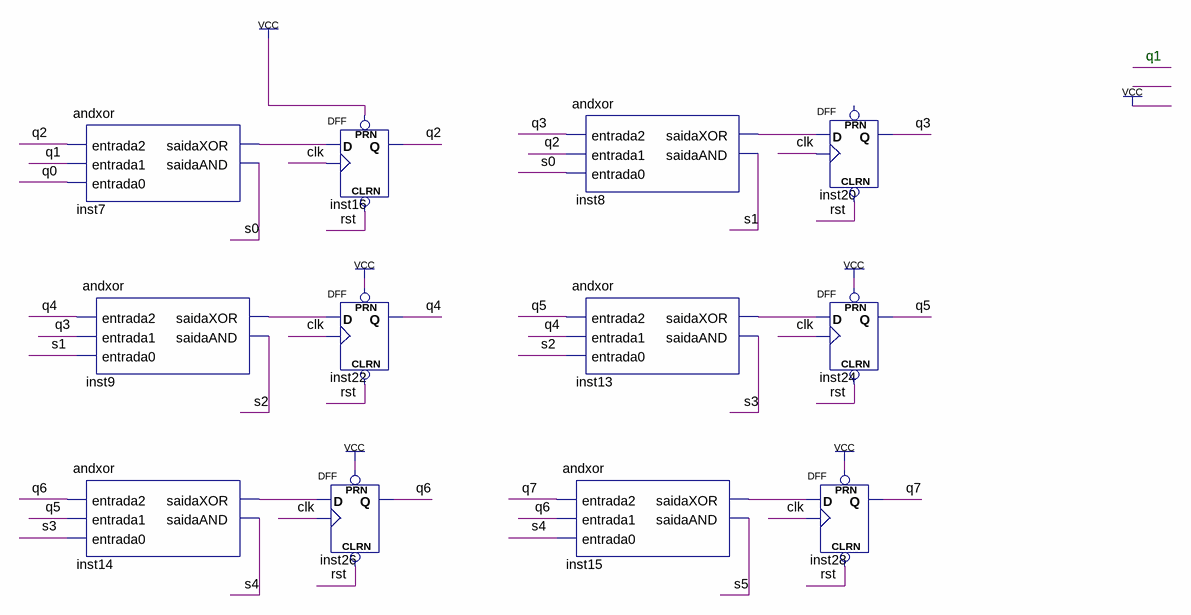
[diagram p0: schematic sheet]
// Quartus schematic jhb.bdf as structural Verilog: 12 symbols, 0 pins
module jhb (
);

  wire clk, inst7_saidaxor, inst8_saidaxor, inst9_saidaxor, inst13_saidaxor, inst14_saidaxor,
       inst15_saidaxor, q0, q1, q2, q3, q4, q5, q6, q7, rst, s0, s1, s2, s3, s4, s5;

  andxor inst7 (.entrada2(q2), .entrada1(q1), .entrada0(q0), .saidaXOR(inst7_saidaxor), .saidaAND(s0));
  andxor inst9 (.entrada2(q4), .entrada1(q3), .entrada0(s1), .saidaXOR(inst9_saidaxor), .saidaAND(s2));
  andxor inst14 (.entrada2(q6), .entrada1(q5), .entrada0(s3), .saidaXOR(inst14_saidaxor), .saidaAND(s4));
  DFF inst16 (.CLRN(rst), .CLK(clk), .D(inst7_saidaxor), .PRN(1'b1), .Q(q2));
  DFF inst22 (.CLRN(rst), .CLK(clk), .D(inst9_saidaxor), .PRN(1'b1), .Q(q4));
  DFF inst26 (.CLRN(rst), .CLK(clk), .D(inst14_saidaxor), .PRN(1'b1), .Q(q6));
  andxor inst8 (.entrada2(q3), .entrada1(q2), .entrada0(s0), .saidaXOR(inst8_saidaxor), .saidaAND(s1));
  andxor inst13 (.entrada2(q5), .entrada1(q4), .entrada0(s2), .saidaXOR(inst13_saidaxor), .saidaAND(s3));
  andxor inst15 (.entrada2(q7), .entrada1(q6), .entrada0(s4), .saidaXOR(inst15_saidaxor), .saidaAND(s5));
  DFF inst20 (.CLRN(rst), .CLK(clk), .D(inst8_saidaxor), .Q(q3));  // open: PRN
  DFF inst24 (.CLRN(rst), .CLK(clk), .D(inst13_saidaxor), .PRN(1'b1), .Q(q5));
  DFF inst28 (.CLRN(rst), .CLK(clk), .D(inst15_saidaxor), .PRN(1'b1), .Q(q7));

  // Notes on the sheet:
  //   q1
endmodule
